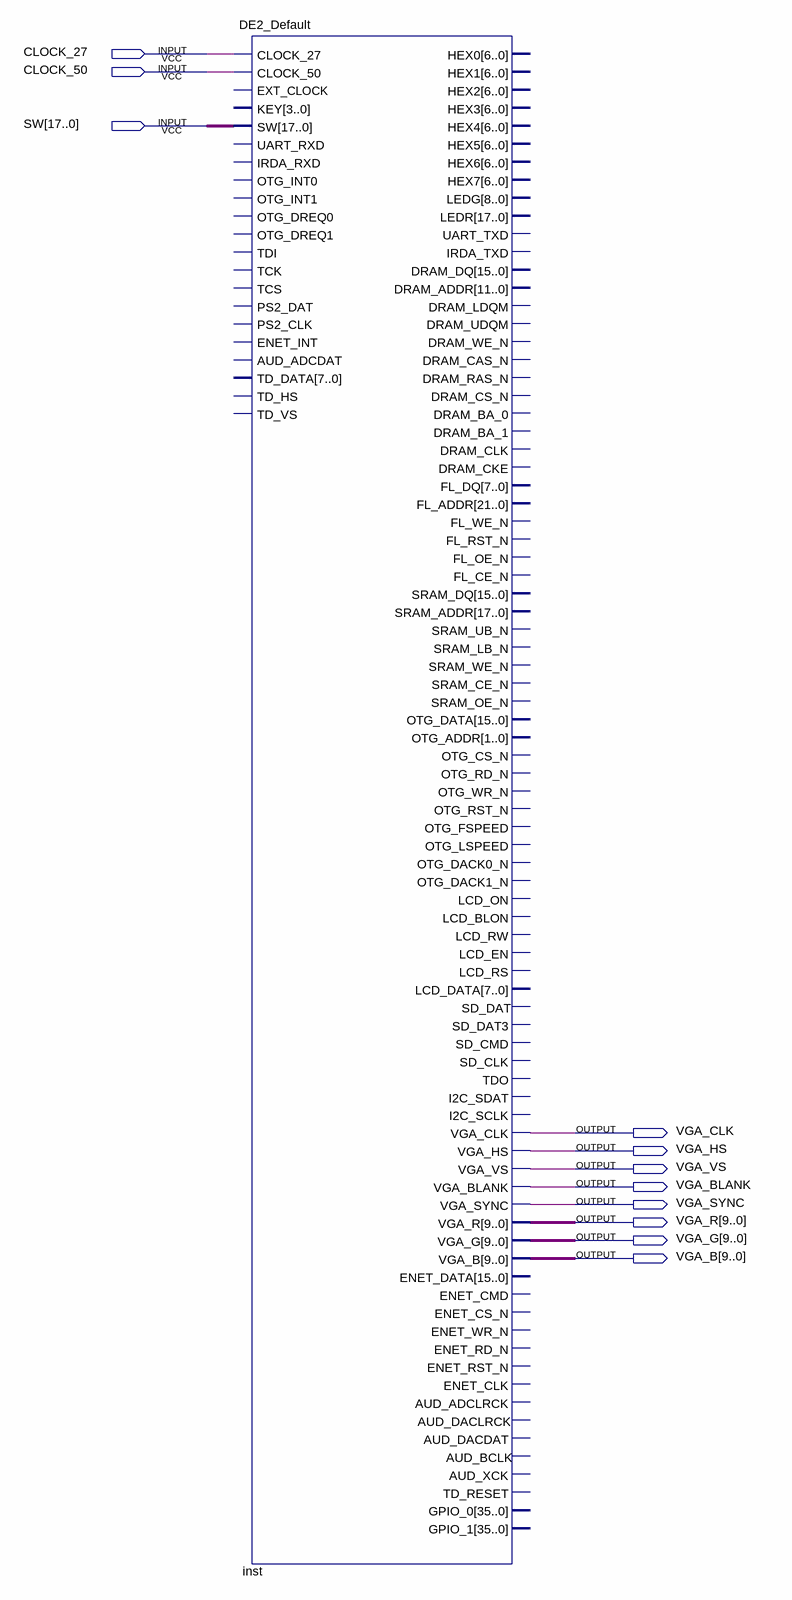
[diagram p0: schematic sheet]
// Quartus schematic top_level.bdf as structural Verilog: 1 symbols, 11 pins
module top_level (
  input  CLOCK_27,
  input  CLOCK_50,
  input  [17:0] SW,
  output VGA_CLK,
  output VGA_HS,
  output VGA_VS,
  output VGA_BLANK,
  output VGA_SYNC,
  output [9:0] VGA_R,
  output [9:0] VGA_G,
  output [9:0] VGA_B
);

  DE2_Default inst (
    .CLOCK_27(CLOCK_27), .CLOCK_50(CLOCK_50), .SW(SW), .VGA_CLK(VGA_CLK), .VGA_HS(VGA_HS), .VGA_VS(VGA_VS),
    .VGA_BLANK(VGA_BLANK), .VGA_SYNC(VGA_SYNC), .VGA_R(VGA_R), .VGA_G(VGA_G), .VGA_B(VGA_B));  // open: EXT_CLOCK, KEY, UART_RXD, IRDA_RXD, OTG_INT0, OTG_INT1, OTG_DREQ0, OTG_DREQ1, TDI, TCK, TCS, PS2_DAT, PS2_CLK, ENET_INT, AUD_ADCDAT, TD_DATA, TD_HS, TD_VS, HEX0, HEX1, HEX2, HEX3, HEX4, HEX5, HEX6, HEX7, LEDG, LEDR, UART_TXD, IRDA_TXD, DRAM_ADDR, DRAM_LDQM, DRAM_UDQM, DRAM_WE_N, DRAM_CAS_N, DRAM_RAS_N, DRAM_CS_N, DRAM_BA_0, DRAM_BA_1, DRAM_CLK, DRAM_CKE, FL_ADDR, FL_WE_N, FL_RST_N, FL_OE_N, FL_CE_N, SRAM_ADDR, SRAM_UB_N, SRAM_LB_N, SRAM_WE_N, SRAM_CE_N, SRAM_OE_N, OTG_ADDR, OTG_CS_N, OTG_RD_N, OTG_WR_N, OTG_RST_N, OTG_FSPEED, OTG_LSPEED, OTG_DACK0_N, OTG_DACK1_N, LCD_ON, LCD_BLON, LCD_RW, LCD_EN, LCD_RS, SD_CLK, TDO, I2C_SCLK, ENET_CMD, ENET_CS_N, ENET_WR_N, ENET_RD_N, ENET_RST_N, ENET_CLK, AUD_ADCLRCK, AUD_DACDAT, AUD_XCK, TD_RESET, DRAM_DQ, FL_DQ, SRAM_DQ, OTG_DATA, LCD_DATA, SD_DAT, SD_DAT3, SD_CMD, I2C_SDAT, ENET_DATA, AUD_DACLRCK, AUD_BCLK, GPIO_0, GPIO_1
endmodule
